# Altium schematic sheet Connect.SchDoc
size A4
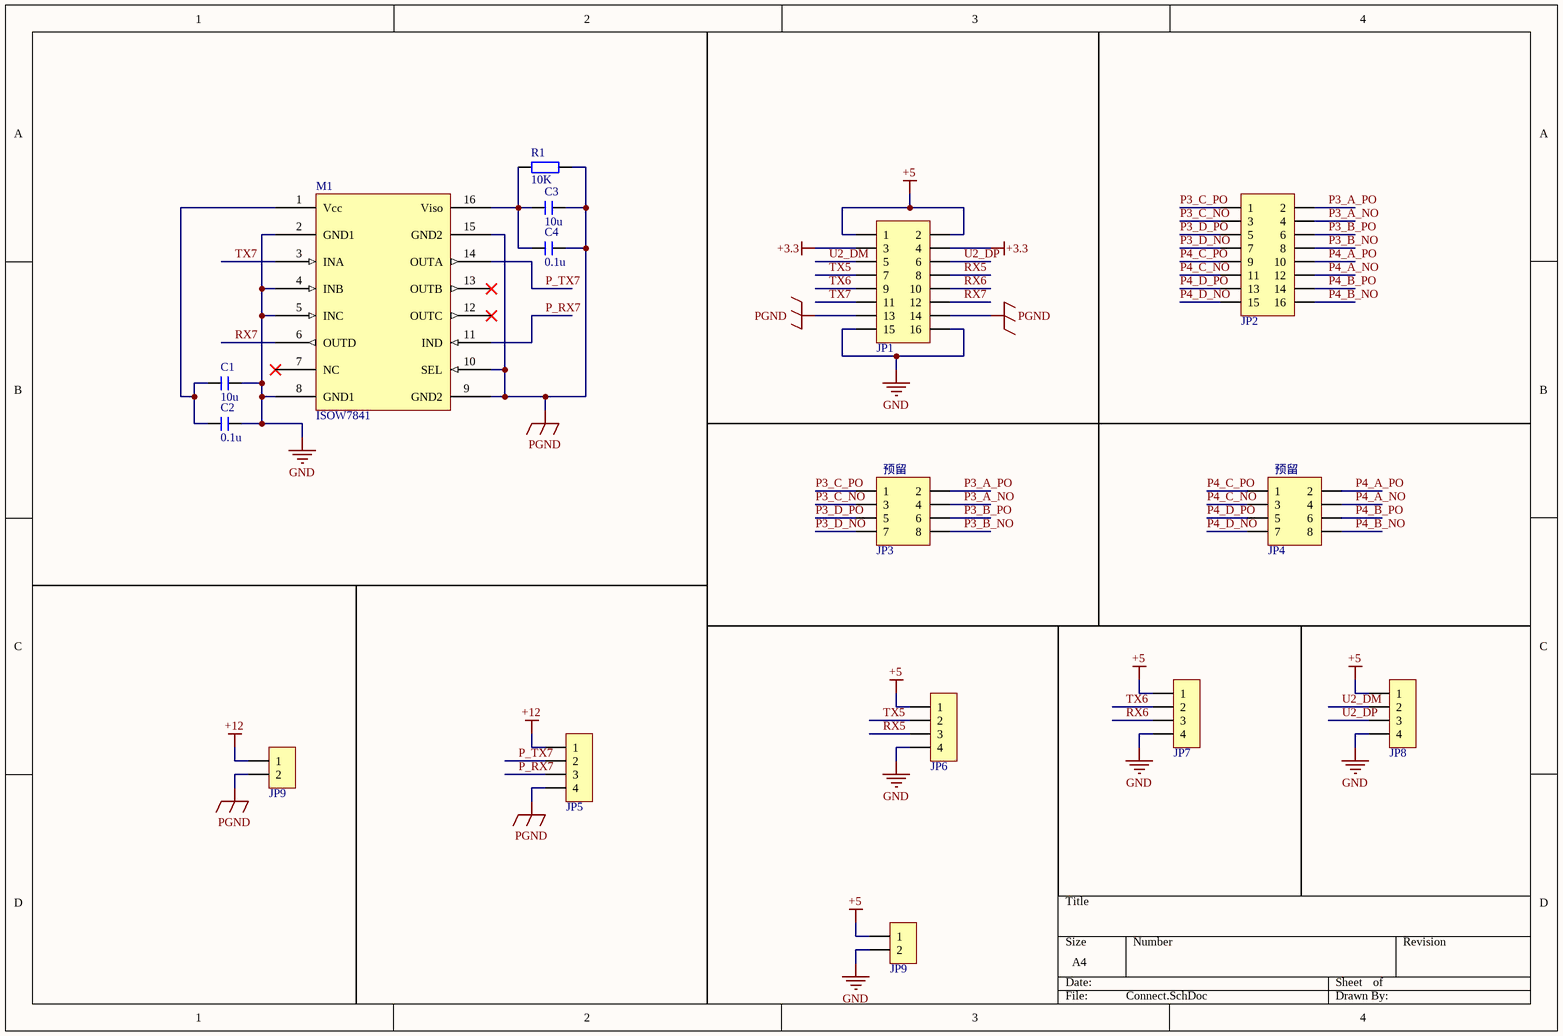
[diagram p0: Connect.SchDoc]

## Parts
(Parts that share a designator on the sheet are numbered #1, #2 ... from top to bottom, then left to right.)
C1  10u  [C 0603_M]
C2  0.1u  [C 0603_M]
C3  10u  [C 0603_M]
C4  0.1u  [C 0603_M]
JP1  Header 8X2  [IDC2.54-LI-2x8P]  (value not drawn)
JP2  Header 8X2  [IDC2.54-LI-2x8P]  (value not drawn)
JP3  预留  [PHB2.0-LI-2x4P]
JP4  预留  [PHB2.0-LI-2x4P]
JP5  HDR-1X4  [PH2.0-LS-4P]  (value not drawn)
JP6  HDR-1X4  [PH2.0-LS-4P]  (value not drawn)
JP7  HDR-1X4  [PH2.0-LS-4P]  (value not drawn)
JP8  HDR-1X4  [PH2.0-LS-4P]  (value not drawn)
JP9#1  HDR-1X2  [KF128-5.08-2P]  (value not drawn)
JP9#2  HDR-1X2  [HDR2.54-LI-2P]  (value not drawn)
M1  ISOW7841  [7840]
R1  10K  [R 0603_M]

## Nets
+3.3: JP1.3 JP1.4
+5: JP1.1 JP1.2 JP6.1 JP7.1 JP8.1 JP9#2.1
+12: JP5.1 JP9#1.1
GND: C1.2 C2.2 JP1.15 JP1.16 JP6.4 JP7.4 JP8.4 JP9#2.2 M1.2(GND1) M1.4(INB) M1.5(INC) M1.8(GND1)
PGND: C3.2 C4.2 JP1.13 JP1.14 JP5.4 JP9#1.2 M1.9(GND2) M1.10(SEL) M1.15(GND2) R1.2
P3_A_NO: JP2.4 JP3.4
P3_A_PO: JP2.2 JP3.2
P3_B_NO: JP2.8 JP3.8
P3_B_PO: JP2.6 JP3.6
P3_C_NO: JP2.3 JP3.3
P3_C_PO: JP2.1 JP3.1
P3_D_NO: JP2.7 JP3.7
P3_D_PO: JP2.5 JP3.5
P4_A_NO: JP2.12 JP4.4
P4_A_PO: JP2.10 JP4.2
P4_B_NO: JP2.16 JP4.8
P4_B_PO: JP2.14 JP4.6
P4_C_NO: JP2.11 JP4.3
P4_C_PO: JP2.9 JP4.1
P4_D_NO: JP2.15 JP4.7
P4_D_PO: JP2.13 JP4.5
P_RX7: JP5.3 M1.11(IND)
P_TX7: JP5.2 M1.14(OUTA)
RX5: JP1.8 JP6.3
RX6: JP1.10 JP7.3
RX7: JP1.12 M1.6(OUTD)
TX5: JP1.7 JP6.2
TX6: JP1.9 JP7.2
TX7: JP1.11 M1.3(INA)
U2_DM: JP1.5 JP8.2
U2_DP: JP1.6 JP8.3
NetC1_1: C1.1 C2.1 M1.1(Vcc)
NetC3_1: C3.1 C4.1 M1.16(Viso) R1.1

Not connected (* = marked no-connect by the designer): M1 7(NC)* 12(OUTC)* 13(OUTB)*

## Library data of the parts
C1-C4 = C: 无极性贴片电容; 版权归属: 源创客; BOM名称: 无极性贴片电容; 学习资源: www.ooocke.com
JP1 JP2 = Header 8X2: 8*2P接插件; 版权归属: 源创客; BOM名称: 8*2P接插件; 学习资源: www.ooocke.com
JP3 JP4 = Header 4X2: 4*2P接插件; 版权归属: 源创客; BOM名称: 4*2P接插件; 学习资源: www.ooocke.com
JP5-JP8 = Header 4: 4P接插件; 版权归属: 源创客; BOM名称: 4P接插件; 学习资源: www.ooocke.com
JP9#1 JP9#2 = Header 2: 2P接插件; 版权归属: 源创客; BOM名称: 2P接插件; 学习资源: www.ooocke.com
R1 = R: 贴片电阻; 版权归属: 源创客; BOM名称: 贴片电阻; 学习资源: www.ooocke.com